# EAGLE design Arduino_MEGA_2560-Rev3 (EAGLE 6.1)
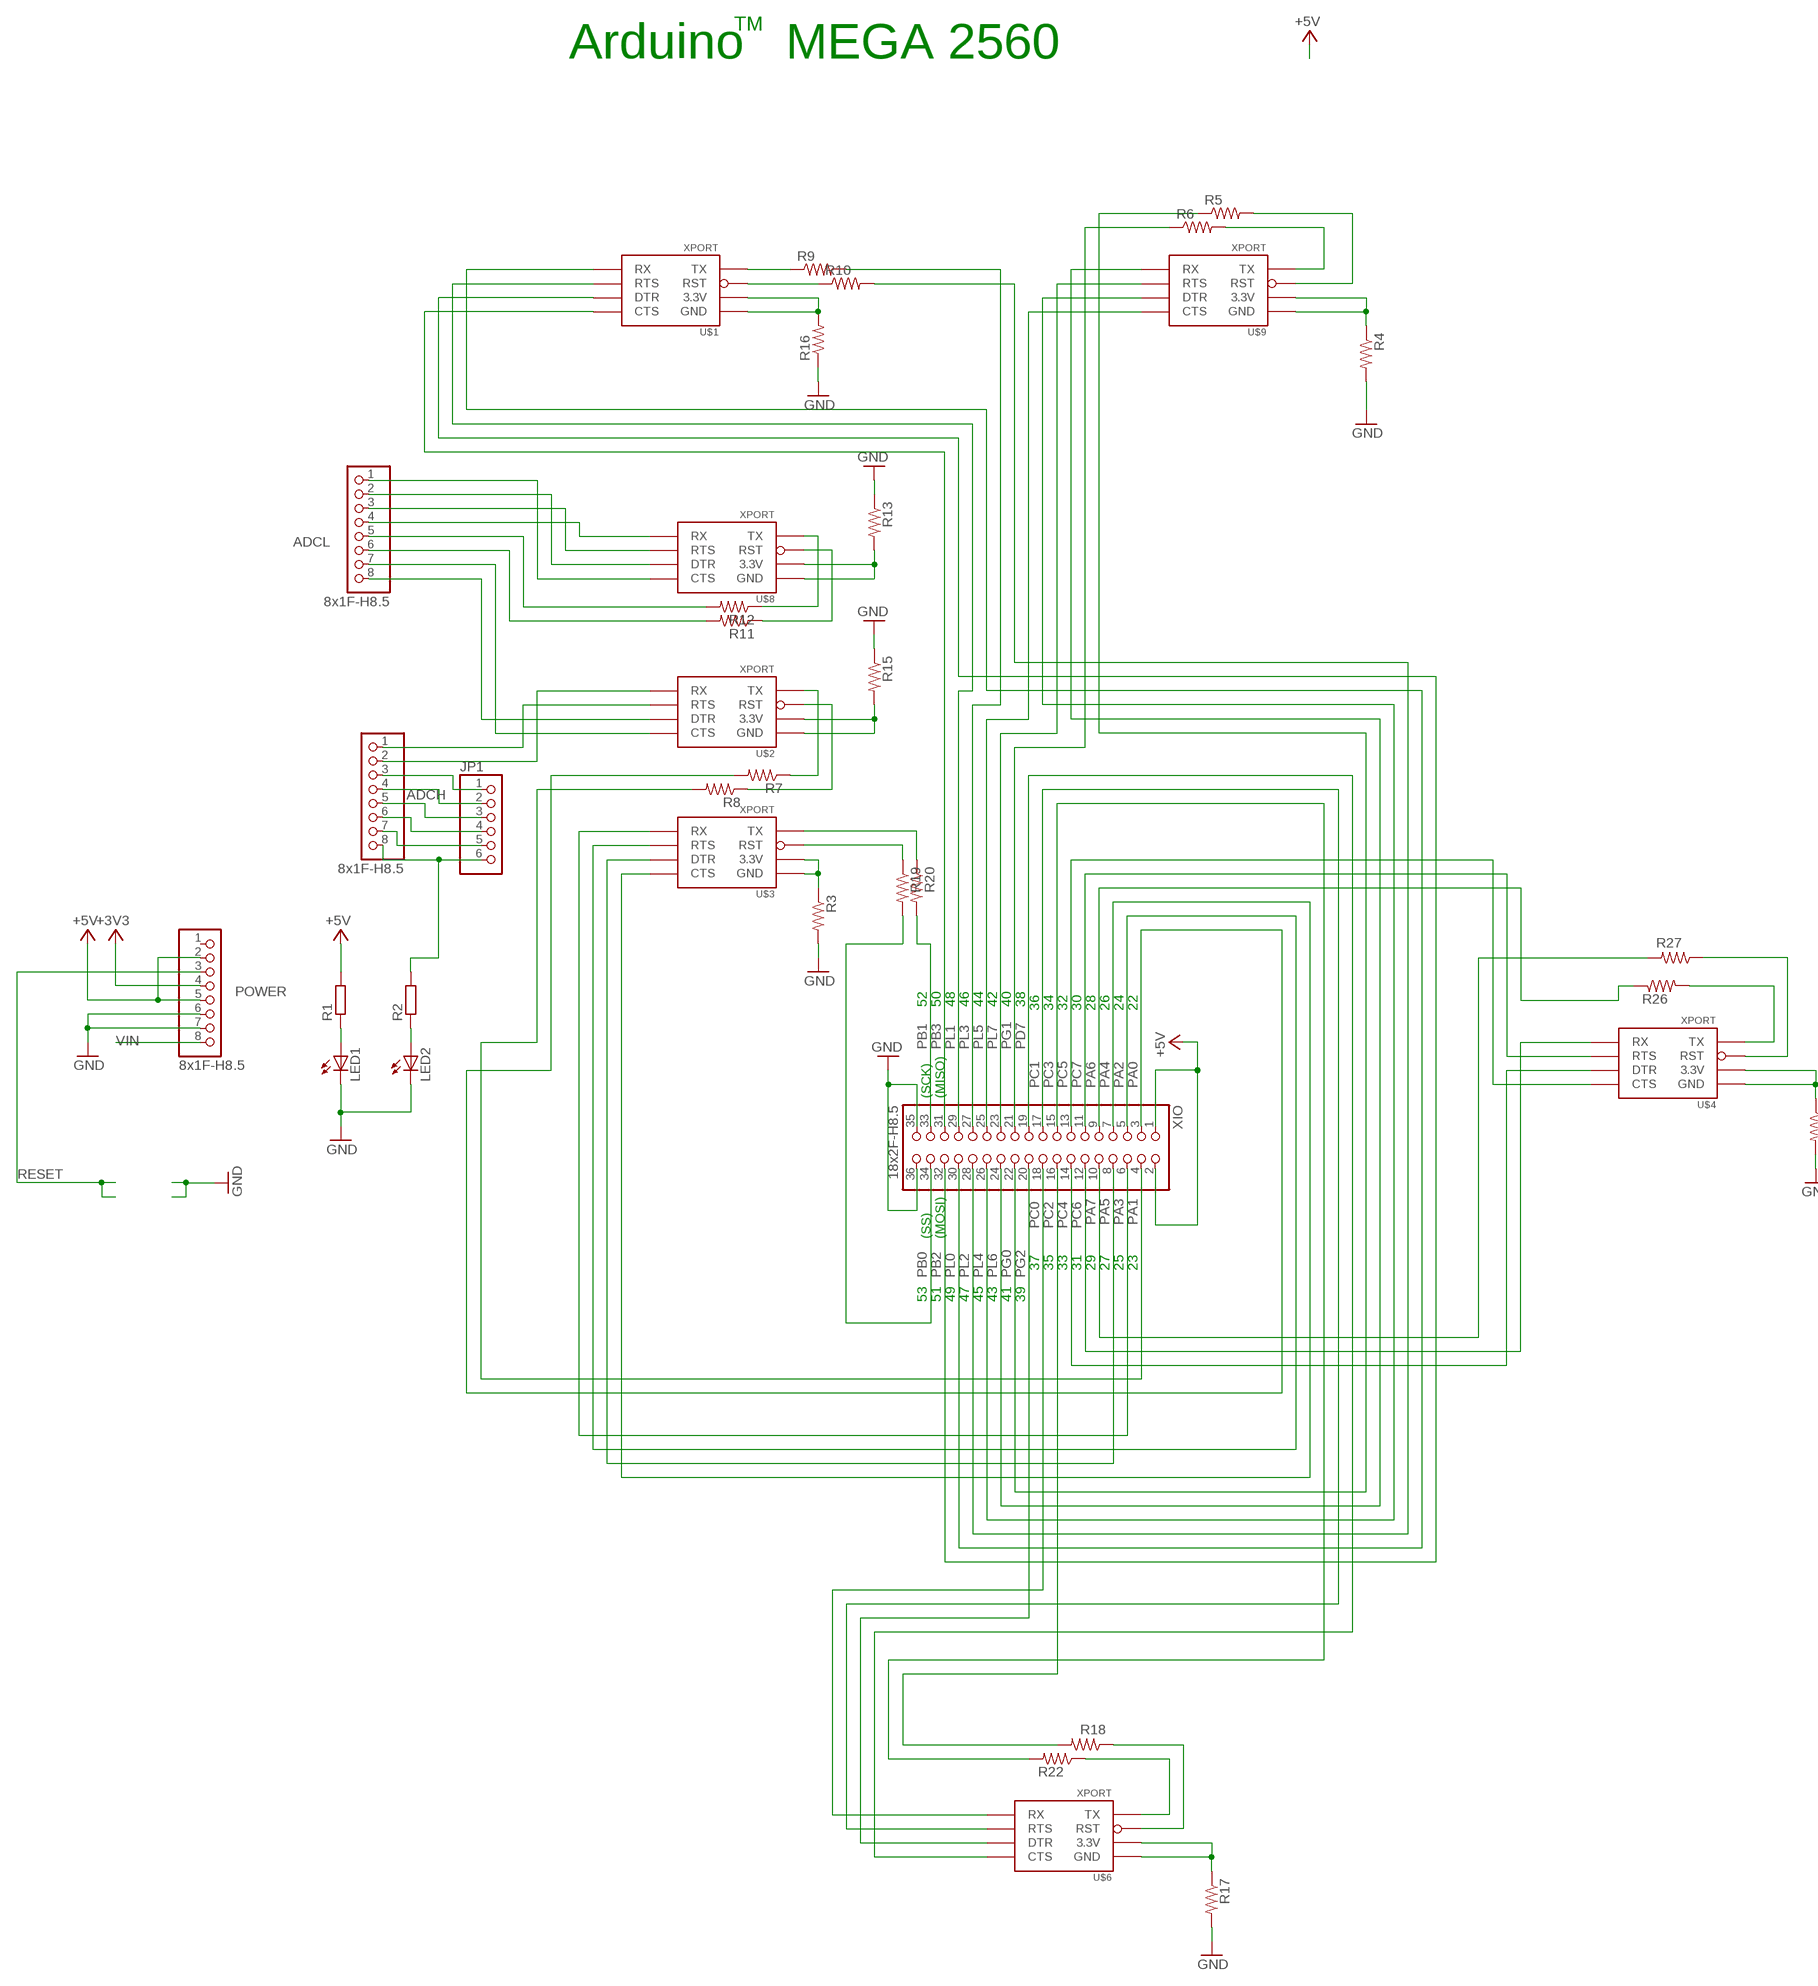
[diagram p0: schematic, sheet 1, part 1 of 2]
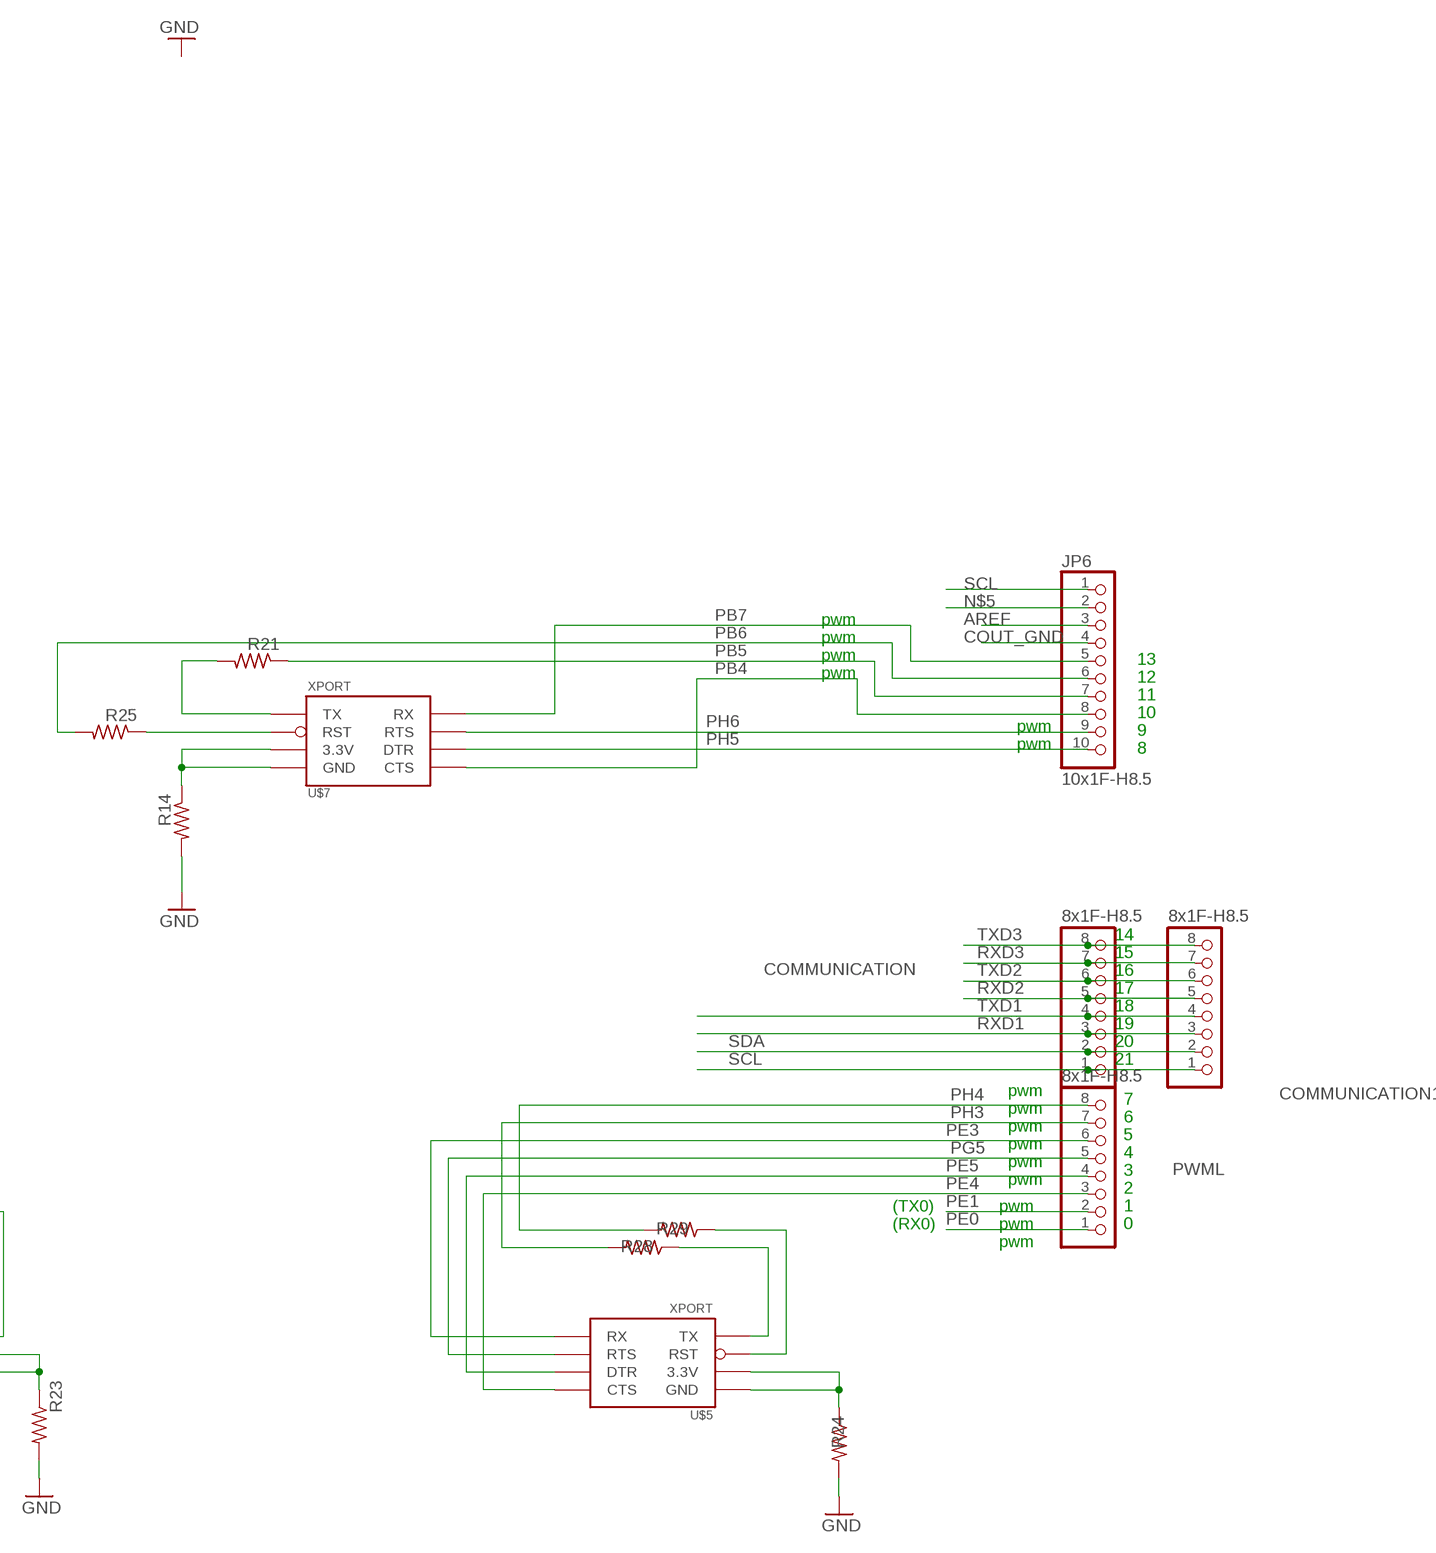
[diagram p1: schematic, sheet 1, part 2 of 2]

## Parts
ADCH  8x1F-H8.5  PINHD-1X8  [1X08]
ADCL  8x1F-H8.5  PINHD-1X8  [1X08]
COMMUNICATION  8x1F-H8.5  PINHD-1X8  [1X08]
COMMUNICATION1  8x1F-H8.5  PINHD-1X8  [1X08]
JP1  PINHD-1X6  [1X06]
JP6  10x1F-H8.5  PINHD-1X10_ARD  [1X10]
LED1  LEDCHIPLED_1206  [CHIPLED_1206]
LED2  LEDCHIPLED_1206  [CHIPLED_1206]
POWER  8x1F-H8.5  PINHD-1X8  [1X08]
PWML  8x1F-H8.5  PINHD-1X8  [1X08]
R1  R-EU_M1206  [M1206]
R2  R-EU_M1206  [M1206]
R3  R-US_0207/10  [0207/10]
R4  R-US_0207/15  [0207/15]
R5  R-US_0207/15  [0207/15]
R6  R-US_0207/15  [0207/15]
R7  R-US_0207/10  [0207/10]
R8  R-US_0207/10  [0207/10]
R9  R-US_0207/15  [0207/15]
R10  R-US_0207/15  [0207/15]
R11  R-US_0207/10  [0207/10]
R12  R-US_0207/10  [0207/10]
R13  R-US_0207/10  [0207/10]
R14  R-US_0207/10  [0207/10]
R15  R-US_0207/10  [0207/10]
R16  R-US_0207/15  [0207/15]
R17  R-US_0207/15  [0207/15]
R18  R-US_0207/15  [0207/15]
R19  R-US_0207/10  [0207/10]
R20  R-US_0207/10  [0207/10]
R21  R-US_0207/2V  [0207/2V]
R22  R-US_0207/15  [0207/15]
R23  R-US_0207/15  [0207/15]
R24  R-US_0207/15  [0207/15]
R25  R-US_0207/2V  [0207/2V]
R26  R-US_0207/15  [0207/15]
R27  R-US_0207/15  [0207/15]
R28  R-US_0207/15  [0207/15]
R29  R-US_0207/15  [0207/15]
U$1  XPORT  [XPORT]
U$2  XPORT  [XPORT]
U$3  XPORT  [XPORT]
U$4  XPORT  [XPORT]
U$5  XPORT  [XPORT]
U$6  XPORT  [XPORT]
U$7  XPORT  [XPORT]
U$8  XPORT  [XPORT]
U$9  XPORT  [XPORT]
XIO  18x2F-H8.5  PINHD-2X18  [2X18]

## Nets
+3V3 [power]: POWER.4
+5V [power usb]: POWER.2 POWER.5 R1.2 XIO.1 XIO.2
AREF: JP6.3
COUT_GND: JP6.4 LED1.C LED2.C POWER.6 POWER.7 R3.2 R4.2 R13.1 R14.2 R15.1 R16.1 R17.2 R23.2 R24.2 XIO.35 XIO.36 ; supply symbol labelled GND
N$1: LED1.A R1.1
N$2: LED2.A R2.1
N$3: ADCH.1 U$2.P6(RTS)
N$4: ADCH.2 U$2.P5(RX)
N$5: JP6.2
N$6 [gnd]: R14.1 U$7.P1(GND) U$7.P2(3.3V)
N$7: ADCL.1 U$8.P8(CTS)
N$8: ADCL.2 U$8.P7(DTR)
N$9: ADCL.3 U$8.P6(RTS)
N$10: ADCH.3 JP1.1
N$11: ADCL.4 U$8.P5(RX)
N$12: ADCL.5 R12.2
N$13: ADCL.6 R11.2
N$14: ADCL.7 U$2.P8(CTS)
N$15: ADCL.8 U$2.P7(DTR)
N$16 [gnd]: R15.2 U$2.P1(GND) U$2.P2(3.3V)
N$17 [gnd]: R3.1 U$3.P1(GND) U$3.P2(3.3V)
N$18 [gnd]: R4.1 U$9.P1(GND) U$9.P2(3.3V)
N$19: R5.2 U$9.P3(RST)
N$20: R6.2 U$9.P4(TX)
N$21: ADCH.4 JP1.2
N$22: ADCH.5 JP1.3
N$23: ADCH.6 JP1.4
N$24: ADCH.7 JP1.5
N$25: ADCH.8 JP1.6 R2.2
N$26 [gnd]: R16.2 U$1.P1(GND) U$1.P2(3.3V)
N$27: R10.1 U$1.P3(RST)
N$28: R9.1 U$1.P4(TX)
N$29 [gnd]: R17.1 U$6.P1(GND) U$6.P2(3.3V)
N$30: R7.1 U$2.P4(TX)
N$31: R8.1 U$2.P3(RST)
N$32: R22.1 U$6.P4(TX)
N$33: R18.1 U$6.P3(RST)
N$34 [gnd]: R24.1 U$5.P1(GND) U$5.P2(3.3V)
N$35 [gnd]: R23.1 U$4.P1(GND) U$4.P2(3.3V)
N$36: R19.1 U$3.P3(RST)
N$37: R20.2 XIO.33
N$38: R21.2 U$7.P4(TX)
N$39: R25.1 U$7.P3(RST)
N$40: R28.1 U$5.P4(TX)
N$41: R29.1 U$5.P3(RST)
N$42: R26.2 U$4.P4(TX)
N$43: R27.1 U$4.P3(RST)
N$44: R11.1 U$8.P3(RST)
N$45: R12.1 U$8.P4(TX)
N$46 [gnd]: R13.2 U$8.P1(GND) U$8.P2(3.3V)
PA0: R7.2 XIO.3
PA1: R8.2 XIO.4
PA2: U$3.P6(RTS) XIO.5
PA3: U$3.P5(RX) XIO.6
PA4: U$3.P8(CTS) XIO.7
PA5: U$3.P7(DTR) XIO.8
PA6: R26.1 XIO.9
PA7: R27.2 XIO.10
PB0: R19.2 XIO.34
PB1: R20.1 U$3.P4(TX)
PB2: U$1.P7(DTR) XIO.32
PB3: U$1.P8(CTS) XIO.31
PB4: JP6.8 U$7.P8(CTS)
PB5: JP6.7 R21.1
PB6: JP6.6 R25.2
PB7: JP6.5 U$7.P5(RX)
PC0: U$6.P5(RX) XIO.18
PC1: U$6.P6(RTS) XIO.17
PC2: R18.2 XIO.16
PC3: R22.2 XIO.15
PC4: U$4.P7(DTR) XIO.14
PC5: U$4.P8(CTS) XIO.13
PC6: U$4.P5(RX) XIO.12
PC7: U$4.P6(RTS) XIO.11
PD7: U$6.P8(CTS) XIO.19
PE0: PWML.1
PE1: PWML.2
PE3: PWML.6 U$5.P5(RX)
PE4: PWML.3 U$5.P8(CTS)
PE5: PWML.4 U$5.P7(DTR)
PG0: R5.1 XIO.22
PG1: R6.1 XIO.21
PG2: U$6.P7(DTR) XIO.20
PG5: PWML.5 U$5.P6(RTS)
PH3: PWML.7 R28.2
PH4: PWML.8 R29.2
PH5: JP6.10 U$7.P7(DTR)
PH6: JP6.9 U$7.P6(RTS)
PL0: U$1.P5(RX) XIO.30
PL1: U$1.P6(RTS) XIO.29
PL2: R10.2 XIO.28
PL3: R9.2 XIO.27
PL4: U$9.P7(DTR) XIO.26
PL5: U$9.P8(CTS) XIO.25
PL6: U$9.P5(RX) XIO.24
PL7: U$9.P6(RTS) XIO.23
RESET: POWER.3
RXD1: COMMUNICATION1.3 COMMUNICATION.3
RXD2: COMMUNICATION1.5 COMMUNICATION.5
RXD3: COMMUNICATION1.7 COMMUNICATION.7
SCL: COMMUNICATION1.1 COMMUNICATION.1 JP6.1
SDA: COMMUNICATION1.2 COMMUNICATION.2
TXD1: COMMUNICATION1.4 COMMUNICATION.4
TXD2: COMMUNICATION1.6 COMMUNICATION.6
TXD3: COMMUNICATION1.8 COMMUNICATION.8
VIN [power]: POWER.8
Unconnected: POWER.1

## Notes on the sheet
- TM
- Arduino   MEGA 2560
- pwm
- pwm
- pwm | 13
- pwm | 12
- 11
- 10
- pwm | 9
- pwm | 8
- 14
- 15
- 16
- 17
- 18
- 19
- 20
- 21
- pwm
- 7
- pwm
- 6
- pwm
- 5
- pwm
- 4
- pwm
- 3
- pwm
- 2
- (TX0) | pwm | 1
- (RX0) | pwm | 0
- pwm
- 52 | 50 | 48 | 46 | 44 | 42 | 40 | 38 | 36 | 34 | 32 | 30 | 28 | 26 | 24 | 22
- (SCK) | (MISO)
- (SS) | (MOSI)
- 37 | 35 | 33 | 31 | 29 | 27 | 25 | 23
- 53 | 51 | 49 | 47 | 45 | 43 | 41 | 39

## Library data of the parts
ADCH ADCL COMMUNICATION COMMUNICATION1 POWER PWML = SmartPrj:PINHD-1X8: PIN HEADER
JP1 = pinhead:PINHD-1X6: PIN HEADER
JP6 = SmartPrj:PINHD-1X10_ARD: PIN HEADER
LED1 LED2 = led:LED: LED OSRAM: - CHIPLED LG R971, LG N971, LY N971, LG Q971, LY Q971, LO R971, LY R971 LH N974, LH R974 LS Q976, LO Q976, LY Q976 LO Q996 - Hyper CHIPLED LW Q18S LB Q993, LB Q99A, LB R99A - SideLED LS A670, LO A670, LY A670, LG A670, LP A670 LB A673, LV A673, LT A673, LW A673 LH A674 LY A675 LS A676, LA A676, LO A676, LY A676, LW A676 LS A679, LY A679, LG A679 - Hyper Micro SIDELED® LS Y876, LA Y876, LO Y876, LY Y876 LT Y87S - SmartLED LW L88C, LW L88S LB L89C, LB L89S, LG L890 LS L89K, LO L89K, LY L89K LS L896, LA L896, LO L896, LY L896 - TOPLED LS T670, LO T670, LY T670, LG T670, LP T670 LSG T670, LSP T670, LSY T670, LOP T670, LYG T670 LG T671, LOG T671, LSG T671 LB T673, LV T673, LT T673, LW T673 LH T674 LS T676, LA T676, LO T676, LY T676, LB T676, LH T676, LSB T676, LW T676 LB T67C, LV T67C, LT T67C, LS T67K, LO T67K, LY T67K, LW E67C LS E67B, LA E67B, LO E67B, LY E67B, LB E67C, LV E67C, LT E67C LW T67C LS T679, LY T679, LG T679 LS T770, LO T770, LY T770, LG T770, LP T770 LB T773, LV T773, LT T773, LW T773 LH T774 LS E675, LA E675, LY E675, LS T675 LS T776, LA T776, LO T776, LY T776, LB T776 LHGB T686 LT T68C, LB T68C - Hyper Mini TOPLED® LB M676 - Mini TOPLED Santana® LG M470 LS M47K, LO M47K, LY M47K Source: http://www.osram.convergy.de LUXEON: - LUMILED® LXK2-PW12-R00, LXK2-PW12-S00, LXK2-PW14-U00, LXK2-PW14-V00 LXK2-PM12-R00, LXK2-PM12-S00, LXK2-PM14-U00 LXK2-PE12-Q00, LXK2-PE12-R00, LXK2-PE12-S00, LXK2-PE14-T00, LXK2-PE14-U00 LXK2-PB12-K00, LXK2-PB12-L00, LXK2-PB12-M00, LXK2-PB14-N00, LXK2-PB14-P00, LXK2-PB14-Q00 LXK2-PR12-L00, LXK2-PR12-M00, LXK2-PR14-Q00, LXK2-PR14-R00 LXK2-PD12-Q00, LXK2-PD12-R00, LXK2-PD12-S00 LXK2-PH12-R00, LXK2-PH12-S00 LXK2-PL12-P00, LXK2-PL12-Q00, LXK2-PL12-R00 Source: www.luxeon.com KINGBRIGHT: KA-3528ASYC Source: www.kingbright.com
R1 R2 = resistor:R-EU_: RESISTOR, European symbol
R3-R29 = rcl:R-US_: RESISTOR, American symbol
U$1-U$9 = SparkFun-Boards:XPORT: TCP/IP stack and phy in RJ-45 jack footprint
XIO = SmartPrj:PINHD-2X18: PIN HEADER

## Net classes
0 default: width 0.203 mm, drill 0.406 mm, clearance 0.203 mm
1 power: width 0.61 mm, drill 0.406 mm, clearance 0.203 mm
2 gnd: width 0.305 mm, drill 0.406 mm, clearance 0.203 mm
3 power usb: width 0.508 mm, drill 0.406 mm, clearance 0.203 mm

## Board
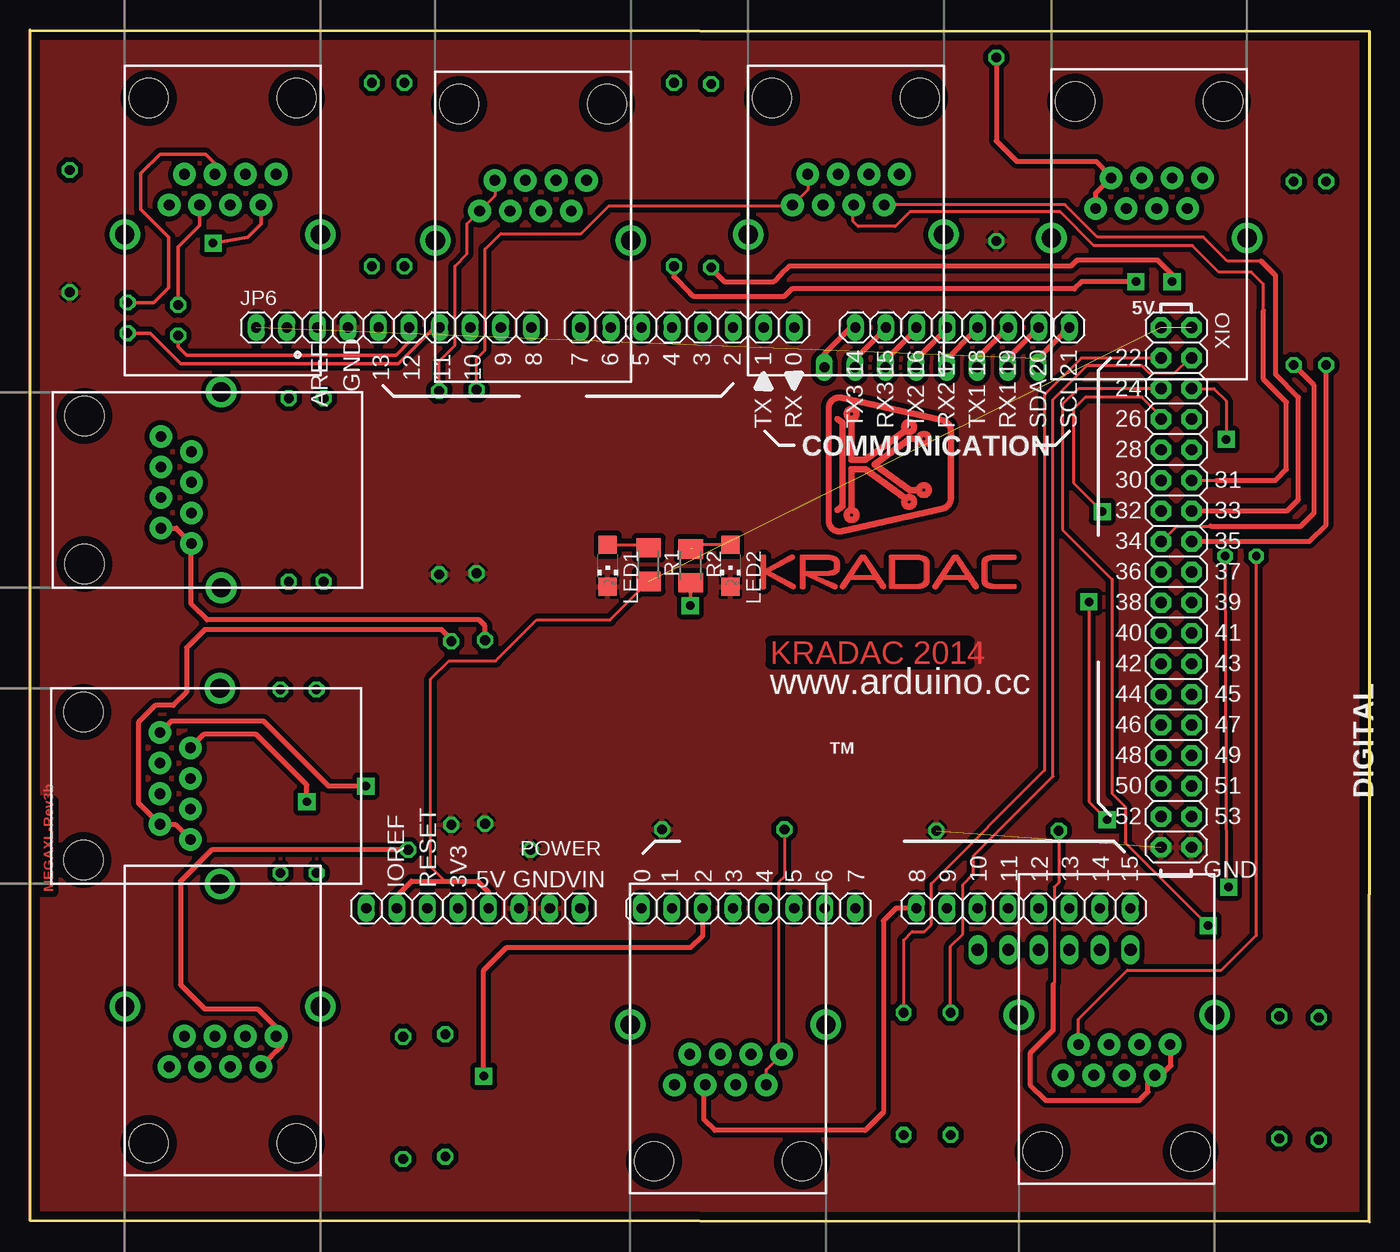
[diagram p2: board, top side]
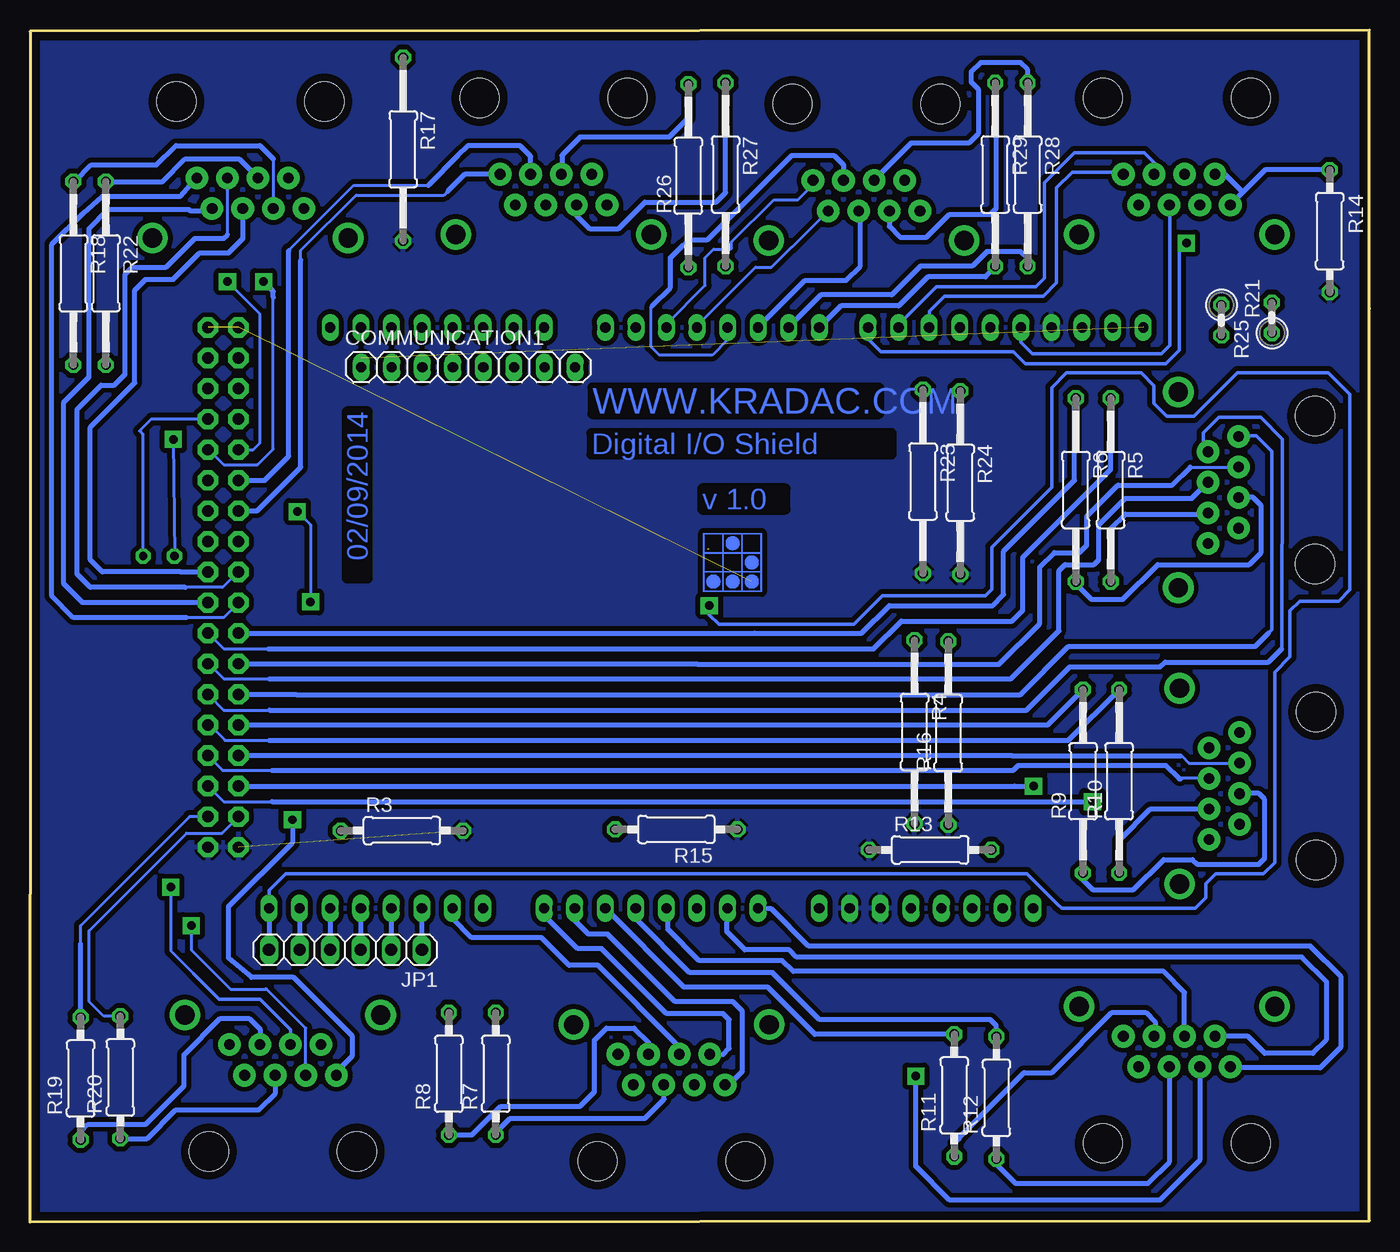
[diagram p3: board, bottom side, seen from below]

Size 111.3 x 99 mm. Coordinates in mm from the lower left corner, seen from the top.
Outline: 0,75.84 0,0.1 111.3,0 111.3,27.2
Outline: 0,75.9 0,99 111.3,98.9 111.3,27.21
Copper layers (1*16): Top 0.035mm / dielectric 1.5mm / Bottom 0.035mm
Design rules: minimum track width 8mil, minimum drill 16mil, track to track 7mil, track to pad 7mil, pad to pad 8mil, via to via 10mil, smd to smd 7mil, copper to edge 27mil, drill to drill 12mil, minimum pad ring 10mil, minimum via ring 10mil, stop-mask expansion 2mil, vias tented up to drill 24mil, thermal gap 10mil

### Footprints (pad centres in the part's own frame; a part is rotated, then mirrored left to right if it is on the bottom)
1X08 = drill 0.85 pad 1.422 long: 1 -8.89,0; 2 -6.35,0; 3 -3.81,0; 4 -1.27,0; 5 1.27,0; 6 3.81,0; 7 6.35,0; 8 8.89,0
1X06 = drill 1.016 long: 1 -6.35,0; 2 -3.81,0; 3 -1.27,0; 4 1.27,0; 5 3.81,0; 6 6.35,0
1X10 = drill 0.85 pad 1.422 long: 1 -11.43,0; 2 -8.89,0; 3 -6.35,0; 4 -3.81,0; 5 -1.27,0; 6 1.27,0; 7 3.81,0; 8 6.35,0; 9 8.89,0; 10 11.43,0
CHIPLED_1206 = smd 1.5 x 1.5: A 0,-1.75; C 0,1.75
M1206 = smd 1.6 x 2: 1 -1.4,0; 2 1.4,0
0207/10 = drill 0.813 octagon: 1 -5.08,0; 2 5.08,0
0207/15 = drill 0.813 octagon: 1 -7.62,0; 2 7.62,0
0207/2V = drill 0.813 octagon: 1 -1.27,0; 2 1.27,0
XPORT = drill 0.889 pad 1.88: 1 -3.175,7.62; 8 4.445,7.62; 10 -4.445,5.08; P1 4.445,7.62; P2 3.175,5.08; P3 1.905,7.62; P4 0.635,5.08; P5 -0.635,7.62; P6 -1.905,5.08; P7 -3.175,7.62; P8 -4.445,5.08 | drill 1.6 pad 2.54: GND@9 -8.128,10.081; GND@10 8.128,10.081 | hole 3.251: -6.147,-1.27; 6.147,-1.27
2X18 = drill 0.95 pad 1.676 octagon: 1 -21.59,-1.27; 2 -21.59,1.27; 3 -19.05,-1.27; 4 -19.05,1.27; 5 -16.51,-1.27; 6 -16.51,1.27; 7 -13.97,-1.27; 8 -13.97,1.27; 9 -11.43,-1.27; 10 -11.43,1.27; 11 -8.89,-1.27; 12 -8.89,1.27; 13 -6.35,-1.27; 14 -6.35,1.27; 15 -3.81,-1.27; 16 -3.81,1.27; 17 -1.27,-1.27; 18 -1.27,1.27; 19 1.27,-1.27; 20 1.27,1.27; 21 3.81,-1.27; 22 3.81,1.27; 23 6.35,-1.27; 24 6.35,1.27; 25 8.89,-1.27; 26 8.89,1.27; 27 11.43,-1.27; 28 11.43,1.27; 29 13.97,-1.27; 30 13.97,1.27; 31 16.51,-1.27; 32 16.51,1.27; 33 19.05,-1.27; 34 19.05,1.27; 35 21.59,-1.27; 36 21.59,1.27

### Placement (x,y rotation side)
ADCH  82.55,26.04 0 top
ADCL  59.69,26.04 0 top
COMMUNICATION  77.47,74.3 180 top
COMMUNICATION1  74.9,71 0 bottom
JP1  85.1,22.6 180 bottom
JP6  30.23,74.3 0 top
LED1  48,54.5 180 top
LED2  58.2,54.5 180 top
POWER  36.83,26.04 0 top
PWML  54.61,74.3 180 top
R1  51.4,54.6 270 top
R2  54.9,54.5 270 top
R3  80.4,32.5 0 bottom
R4  37.8,40.7 270 bottom
R5  21.5,60.8 270 bottom
R6  24.4,60.8 270 bottom
R7  72.6,12.3 90 bottom
R8  76.5,12.3 90 bottom
R9  23.8,36.6 90 bottom
R10  20.8,36.6 90 bottom
R11  34.5,10.5 90 bottom
R12  31,10.3 90 bottom
R13  36.5,30.9 0 bottom
R14  3.3,82.3 270 bottom
R15  57.6,32.6 180 bottom
R16  35,40.6 90 bottom
R17  80.3,89.1 270 bottom
R18  107.7,78.8 270 bottom
R19  107.1,11.9 90 bottom
R20  103.8,12 90 bottom
R21  8.1,75.1 90 bottom
R22  105,78.8 270 bottom
R23  37.1,61.5 270 bottom
R24  34,61.4 270 bottom
R25  12.3,74.9 270 bottom
R26  56.6,86.9 90 bottom
R27  53.5,87 270 bottom
R28  28.4,87 270 bottom
R29  31.1,87 270 bottom
U$1  5.7,36.2 270 top
U$2  58,6.3 0 top
U$3  90.3,7.1 0 top
U$4  67.8,92.1 180 top
U$5  41.8,91.6 180 top
U$6  93,91.8 180 top
U$7  16,92.1 180 top
U$8  16,7.8 0 top
U$9  5.8,60.8 270 top
XIO  95.25,52.71 270 top

### Tracks (layer width: path | path; a pad name or v marks a point on that pad's centre or on a via)
+5V  (2 unrouted)
  Top 0.254: 37.2,28.3 34.5,28.3 33.3,29.5 33.3,45.1 34.8,46.6 38.7,46.6 39.9,47.8 | 39.9,47.8 | 39.9,47.8 42.1,50 48.2,50 R1.2
  Top 0.406: POWER.2 30.48,27.08 31.7,28.3 37.2,28.3 38.1,27.4 POWER.5 | POWER.5
COUT_GND  (1 unrouted)
  pour Top (isolate 0.406, rank 5): 0,0.1 111.3,0.1 111.3,98.9 0,98.9
  pour Bottom (isolate 0.406, rank 4): 0,0.1 111.3,0.1 111.3,98.9 0,98.9
N$1
  Top 0.254: LED1.A 51.15,56.25 R1.1
N$2  (1 unrouted)
  Top 0.254: LED2.A 55.35,56.25 55,55.9
N$3
  Top 0.406: ADCH.1 71.94,26.04 70.9,25 70.9,9.1 69.4,7.6 56.9,7.6 56,8.5 56,11.29 U$2.P6
N$4
  Bottom 0.406: U$2.P5 57.37,14.56 64.1,21.3 66.5,21.3 68.8,23.6 74.6,23.6 76.2,25.2 ADCH.2 | ADCH.2
N$6
  Bottom 0.406: R14.1 8.65,87.38 10.52,85.52 | 10.52,85.52 U$7.P1 | U$7.P2 12.02,87.02 10.52,85.52
N$7
  Bottom 0.406: 50.44,26.04 ADCL.1 50.76,26 49.7,26 46.6,22.9 4.9,22.9 2.4,20.4 2.4,14.5 4.1,12.8 11.47,12.8 U$8.P8
N$8
  Bottom 0.406: 53.34,25.64 ADCL.2 53.4,25.98 53.4,24.1 51.9,22.6 48.2,22.6 47.6,22 5.6,22 3.6,20 3.6,15.1 4.7,14 8.7,14 10.1,15.4 12.8,15.4 U$8.P7
N$9  (via drill 0.7 pad 1.42)
  Top 0.406: v37.7,12.1 37.7,20.9 39.6,22.8 54.9,22.8 55.9,23.8 55.9,26.02 ADCL.3
  Bottom 0.406: U$8.P6 14.1,5.11 17.4,1.8 34.9,1.8 37.7,4.6 v37.7,12.1
N$10
  Bottom 0.406: JP1.1 ADCH.3
N$11
  Bottom 0.406: U$8.P5 15.37,19.07 17.1,20.8 47.9,20.8 48.8,21.7 55.7,21.7 58.3,24.3 58.3,25.92 ADCL.4
N$12
  Bottom 0.406: R12.2 31,16.3 31.5,16.8 45.7,16.8 49.6,20.7 56.5,20.7 61,25.2 61,26 ADCL.5
N$13
  Bottom 0.406: R11.2 46.08,15.58 50,19.5 56.96,19.5 ADCL.6
N$14
  Bottom 0.406: U$2.P8 53.22,11.38 52.1,12.5 52.1,17.5 52.9,18.3 57.7,18.3 63.3,23.9 64.9,23.9 66.04,25.04 ADCL.7
N$15
  Bottom 0.406: U$2.P7 53.68,13.92 53.2,14.4 53.2,16.8 53.7,17.3 58.4,17.3 63.8,22.7 65.8,22.7 68.5,25.4 68.5,25.96 ADCL.8
N$16
  Top 0.254: R15.2 62.68,28.68 62.2,28.2 62.2,14.16 U$2.P1 61.17,12.65 U$2.P2
N$17
  Top 0.254: R3.1 85.48,28.18 85.1,27.8 85.1,19.8 85,19.7
  Top 0.406: 85,19.7 85,15.9 83.1,14 83.1,11.4 84.4,10.1 92.2,10.1 92.9,10.8 92.9,11.61 U$3.P2 93.98,12.18 94.8,13 94.8,14.66 U$3.P1
N$18
  Top 0.406: R4.1 37.8,49.5 37.3,50 14.7,50 13.4,51.3 13.4,56.34 U$9.P1 12.15,57.62 U$9.P2
N$19
  Bottom 0.406: R5.2 21.5,57.6 20.3,58.8 13.52,58.8 U$9.P3
N$20
  Bottom 0.406: R6.2 24.4,53 23.1,51.7 20.5,51.7 17.6,54.6 10,54.6 9,55.6 9,59.5 9.7,60.2 10.85,60.2 U$9.P4
N$21
  Bottom 0.406: ADCH.4 JP1.2
N$22
  Bottom 0.406: ADCH.5 JP1.3
N$23
  Bottom 0.406: ADCH.6 JP1.4
N$24
  Bottom 0.406: ADCH.7 JP1.5
N$25  (via drill 0.7 pad 1.42)
  Top 0.305: v54.86,51.19 54.86,53.06 R2.2
  Bottom 0.305: ADCH.8 91.44,27.54 90.07,28.91 28.47,28.91 25.98,26.42 25.96,26.42 25.58,26.04 14.45,26.04 13.59,26.9 13.59,28.07 12.75,28.91 8.81,28.91 7.87,29.85 7.87,45.67 6.6,46.94 6.6,50.75 5.79,51.57 2.56,51.57 1.63,52.51 1.63,68.74 3.4,70.52 11,70.52 14.58,66.93 16.84,66.93 17.91,68 17.91,69.47 18.95,70.52 25.17,70.52 26.39,69.3 26.39,61.02 31.37,56.04 31.37,52.56 31.93,52 40.49,52 42.85,49.64 54.05,49.64 54.86,50.45 v54.86,51.19
  Bottom 0.406: ADCH.8 JP1.6
N$26
  Top 0.406: R16.2 35,48.4 34.2,49.2 14.5,49.2 13,47.7 13,44 11.9,42.9 10.4,42.9 9,41.5 9,34.8 U$1.P2 12.05,33.02 U$1.P1
N$27
  Bottom 0.406: R10.1 20.8,31.7 18.2,34.3 U$1.P3
N$28
  Bottom 0.406: R9.1 23.8,28.4 23,27.6 19.6,27.6 17.1,30.1 14.7,30.1 14.3,29.7 9.2,29.7 8.7,30.2 8.7,35.1 9.2,35.6 10.74,35.6 U$1.P4
N$29
  Top 0.406: R17.1 80.3,89.8 82,88.1 88.6,88.1 89.83,86.88 U$6.P2 88.56,85.45 U$6.P1
N$30
  Bottom 0.406: R7.1 72.6,7.4 71.4,8.6 60.2,8.6 58.6,10.2 58.6,11.35 U$2.P4
N$31
  Bottom 0.406: R8.1 74.58,7.22 72.4,9.4 | 72.4,9.4 | 72.4,9.4 72.2,9.6 65.6,9.6 64.4,10.8 64.4,15.1 63.4,16.1 61.1,16.1 59.9,14.9 U$2.P3
N$32
  Bottom 0.406: R22.1 100.28,86.42 98.4,88.3 93.94,88.3 U$6.P4
N$33
  Bottom 0.254: 91.1,88.3 U$6.P3
  Bottom 0.406: R18.1 107.58,86.42 106.2,87.8 100.8,87.8 99.2,89.4 92.2,89.4 91.1,88.3
N$34
  Top 0.254: R24.1 34,71.5 35.3,72.8 35.3,79.4 36.3,80.4 36.3,82.92 U$5.P1 38.62,85.25 U$5.P2
N$35
  Top 0.254: R23.1 37.1,71.7 37.8,72.4 37.8,80.8 39.1,82.1 45.8,82.1 47.8,84.1 | 47.8,84.1 | 47.8,84.1 48.1,84.4 63.27,84.4 U$4.P1 64.62,85.75 U$4.P2
N$36
  Bottom 0.406: R19.1 107.1,7.5 106.5,8.1 101.7,8.1 98.5,11.3 98.5,13.9 95.5,16.9 93.1,16.9 92.2,16 U$3.P3
N$37
  Bottom 0.254: R20.2 105.18,17.08 106.4,18.3 106.4,24.2 98.3,32.3 95.34,32.3 XIO.33
N$38
  Top 0.305: R21.2 10.27,76.37 11.5,77.6 11.5,81.8 9.2,84.1 9.2,87.1 10.8,88.7 14.6,88.7 15.4,87.9 15.4,87.06 U$7.P4
N$39
  Top 0.305: R25.1 12.3,81 14.1,82.8 U$7.P3
N$40
  Bottom 0.406: R28.1 28.4,95.7 29,96.3 32.3,96.3 33.1,95.5 33.1,94.7 32.5,94.1 32.5,90.4 33.3,89.6 38.09,89.6 U$5.P4
N$41
  Bottom 0.406: U$5.P3 39.9,82.69 39,81.8 36.8,81.8 34.9,83.7 31.5,83.7 31,84.2 31,94.52 R29.1
N$42
  Bottom 0.406: R26.2 56.6,91.7 58.2,90.1 65.6,90.1 67.1,88.6 67.1,87.09 U$4.P4
N$43
  Bottom 0.406: U$4.P3 65.89,83.59 64.8,82.5 62.4,82.5 60.2,84.7 54.3,84.7 53.5,85.5 R27.1
N$44
  Bottom 0.406: R11.1 34.5,6.5 34.1,6.9 34.1,7 28.7,12.4 26.4,12.4 21.4,17.4 18.6,17.4 17.8,16.6 17.8,15.53 U$8.P3
N$45
  Bottom 0.406: R12.1 31,4.8 29.4,3.2 18.4,3.2 16.6,5 16.6,12.85 U$8.P4
N$46
  Top 0.406: R13.2 15.1,30.9 12.5,28.3 12.5,19.7 14.5,17.7 18.9,17.7 20.9,15.7 | 20.9,15.7 20.9,14.6 20,13.7 U$8.P2 | 20.9,15.7 20.73,15.7 U$8.P1
N$47
  cutout Top: 60.54,53.18 74.37,53.18 74.37,54.78 71.67,54.78 71.67,54.77 71.56,54.77 71.56,54.03 64.1,54.03 64.1,55.07 63.12,55.07 62.09,54.04 60.54,54.04
N$48
  cutout Top: 68.25,58.78 68.28,58.78 68.28,67.85 76.33,66.02 76.28,59.62 68.22,58.22
N$49
  cutout Bottom: 50.57,52.43 55.3,52.41 55.3,57.13 50.57,57.13
N$50
  pour Bottom: 50.55,52.2 55.5,52.2 55.5,57.41 50.47,57.41 50.47,52.2
PA0
  Top 0.254: XIO.3 87.36,71.76 84.3,68.7 84.3,37.5 74.9,28.1 74.9,24.7 74.3,24.1 73.3,24.1 72.6,23.4 R7.2
PA1
  Top 0.254: R8.2 76.5,22.9 77.5,23.9 77.5,28 78.4,28.9 78.4,30.4 85,37 85,68.3 87.8,71.1 92.4,71.1 93,70.5 95.1,70.5 96.36,71.76 XIO.4
PA2  (via drill 0.7 pad 1.42)
  Top 0.254: XIO.5 87.12,69.22 85.8,67.9 85.8,57.5 89.9,53.4 89.9,35.6 91,34.5 91,31.5 v97.9,24.6
  Bottom 0.254: U$3.P6 88.39,16.09 91.6,19.3 | 91.7,19.4 91.6,19.3 | 91.6,19.3 94.6,19.3 97.9,22.6 v97.9,24.6
PA3  (via drill 0.7 pad 1.27, 0.7 pad 1.42)
  Top 0.254: XIO.6 98.38,69.22 99.4,68.2 v99.4,65 | v99.3,55.3 99.4,28 v99.6,27.8
  Bottom 0.254: v99.4,65 v99.3,55.3 | v99.6,27.8 99.6,22.5 97.7,20.6
  Bottom 0.305: U$3.P5 89.67,15.96 92.2,18.5 95.6,18.5 97.7,20.6
PA4  (via drill 0.7 pad 1.42)
  Top 0.254: XIO.7 93.98,66.92 92.4,68.5 87.7,68.5 86.7,67.5 86.7,61.4 v89.1,59 | v88,51.5 88,34.9 v89.5,33.4
  Bottom 0.254: v89.1,59 88,57.9 v88,51.5
  Bottom 0.406: U$3.P8 85.86,12.45 84.5,13.8 84.5,15.4 89.4,20.3 92.9,20.3 94.8,21.9 94.8,26.2 89.5,31.5 v89.5,33.4
PA5  (via drill 0.7 pad 1.27)
  Top 0.254: U$3.P7 87.12,16.82 91.2,20.9 99,20.9 100.5,22.4 | 100.5,22.4 | 100.5,22.4 101.9,23.8 v101.9,55.3
  Bottom 0.254: XIO.8 101.22,66.68 102.2,65.7 101.9,65.4 v101.9,55.3
PA6  (via drill 0.7 pad 1.42)
  Top 0.406: R26.1 56.6,79.2 57.7,78.1 61.8,78.1 62.4,78.7 | v94.9,78.1 94.9,78.7 93.7,79.9 87,79.9 86.5,79.4 63.1,79.4 62.4,78.7 | 62.4,78.7
  Bottom 0.254: XIO.9 92.76,64.14 92.2,64.7 92.2,75.4 v94.9,78.1
PA7  (via drill 0.7 pad 1.42)
  Top 0.406: R27.2 53.5,78.5 54.8,77.2 | 54.8,77.2 | 54.8,77.2 55.1,76.9 62.7,76.9 63.3,77.5 86.8,77.5 87.4,78.1 v91.9,78.1
  Bottom 0.254: XIO.10 96.44,64.14 95.2,62.9 92.4,62.9 91.1,64.2 91.1,76.8
  Bottom 0.406: 91.1,76.8 91.1,77.3 v91.9,78.1
PB0
  Bottom 0.254: XIO.34 98.04,33.66 107.1,24.6 107.1,23.08
  Bottom 0.406: R19.2 107.1,23.08
PB1
  Bottom 0.406: R20.1 101.58,6.92 99.2,9.3 92.3,9.3 90.9,10.7 90.9,12.14 U$3.P4
PB2  (via drill 0.7 pad 1.42)
  Top 0.406: v23,34.9 23,36.3 18.8,40.5 14.45,40.5 U$1.P7
  Bottom 0.254: XIO.32 96.5,36.2 95.2,34.9 91.2,34.9
  Bottom 0.406: 91.2,34.9 v23,34.9
PB3  (via drill 0.7 pad 1.42)
  Top 0.406: v27.9,36.2 24.8,36.2 19.4,41.6 11.73,41.6 U$1.P8
  Bottom 0.406: XIO.31 29.5,36.2 | 29.5,36.2 | 29.5,36.2 v27.9,36.2
PB4
  Bottom 0.305: JP6.8 36.58,75.62 35.3,76.9 27.1,76.9 26,78 26,85.9 24.7,87.2 20.62,87.2 U$7.P8
PB5
  Top 0.305: R21.1 9.97,73.83 12.5,71.3 30.6,71.3 33.4,74.1 33.84,74.1 JP6.7
PB6
  Top 0.305: R25.2 12.3,72.7 13,72 30.4,72 31.5,73.1 JP6.6
PB7
  Bottom 0.305: JP6.5 28.96,73.06 28,72.1 17.3,72.1 16.6,72.8 16.6,84.44 U$7.P5
PC0
  Bottom 0.406: XIO.18 98.78,53.98 98.8,54 105.3,54 106.3,55 106.3,66 102.6,69.7 102.6,77.4 101.7,78.3 99.4,78.3 97.2,80.5 94.8,80.5 93.6,81.7 93.6,84.15 U$6.P5
PC1
  Bottom 0.254: XIO.17 94.02,53.98 95.3,52.7 98.4,52.7 | 94.9,82 U$6.P6
  Bottom 0.406: 98.4,52.7 106.3,52.7 107.4,53.8 107.4,67.5 105.4,69.5 104.3,69.5 103.4,70.4 103.4,78.7 102.8,79.3 100,79.3 97.6,81.7 95.2,81.7 94.9,82
PC2
  Top 0.406: XIO.16 106.32,56.52 107.7,57.9 R18.2
PC3
  Top 0.254: XIO.15 94.02,56.52 95.3,57.8 98.1,57.8
  Top 0.406: 98.1,57.8 105.6,57.8 106.7,58.9 106.7,69.48 R22.2
PC4
  Top 0.254: 102.3,79.8 99.5,79.8 97.5,81.8 88.7,81.8 86,84.5 71,84.5 U$4.P7
  Top 0.406: XIO.14 104.46,59.06 105.4,60 105.4,68.5 103.5,70.4 103.5,78.6 102.3,79.8
PC5
  Bottom 0.254: 88.8,79.9 88.8,80.7 84.2,85.3 76.9,85.3 76.6,85.6
  Bottom 0.406: U$4.P8 75.18,87.02 76.6,85.6 | XIO.13 92.44,59.06 88.8,62.7 88.8,79.9
PC6
  Top 0.254: XIO.12 98.6,61.6 | 98.6,61.6 | 102.5,75.7 102.5,77.9 101.5,78.9 98.8,78.9 96.6,81.1 88.4,81.1 85.6,83.9 73.1,83.9 71.9,82.7 68.8,82.7 68.4,83.1 68.4,84.44 U$4.P5
  Top 0.406: 98.6,61.6 103.5,61.6 104.4,62.5 104.4,68.1 102.5,70 102.5,75.7
PC7
  Bottom 0.254: 89.8,80.7 84.4,86.1 78.2,86.1
  Bottom 0.406: U$4.P6 69.7,88.5 70.6,89.4 74.9,89.4 75.8,88.5 | 75.8,88.5 | 75.8,88.5 78.2,86.1 | XIO.11 91.8,61.6 89.8,63.6 89.8,80.7
PD7
  Bottom 0.254: XIO.19 93.98,51.42 95.2,50.2 98.3,50.2
  Bottom 0.406: 98.3,50.2 107.7,50.2 109.5,52 109.5,81.2 106.9,83.8 | 106.9,83.8 | 106.9,83.8 105.3,85.2 98.77,85.2 U$6.P8
PE3
  Bottom 0.406: PWML.6 | PWML.6 46.9,78.2 43.5,78.2 42.3,79.4 42.3,83.84 U$5.P5
PE4
  Bottom 0.254: PWML.3 58.42,74.58 55.2,77.8 55.2,80.1 54.5,80.8 53.1,80.8 53,80.9 53,81.4 49.5,84.9 47.5,84.9 46.24,86.16 U$5.P8
PE5
  Bottom 0.254: PWML.4 55.88,74.42 51,79.3 49.7,79.3 48,81 47.95,81 U$5.P7
PG0
  Bottom 0.254: XIO.22 96.5,48.9 95.2,47.6 91.5,47.6
  Bottom 0.406: 91.5,47.6 41.2,47.6 38.9,49.9 29.7,49.9 28.8,50.8 28.8,55.2 21.5,62.5 R5.1
PG1
  Bottom 0.406: XIO.21 51.1,48.9 | 51.1,48.9 | 51.1,48.9 42.2,48.9 39.9,51.2 31.3,51.2 30.4,52.1 30.4,55.7 24.5,61.6 24.5,68.32 R6.1
PG2
  Bottom 0.406: XIO.20 106.94,51.44 108.5,53 108.5,68.1 106.4,70.2 106.4,82.5 104.8,84.1 98.1,84.1 98,84 96.36,84 U$6.P7
PG5
  Bottom 0.254: 53.34,74.76 53.34,73.26 54.6,72 59,72 59.7,72.7 59.7,76 59.6,76.1
  Bottom 0.406: PWML.5 53.34,74.76 | 59.6,76.1 58.1,77.6 58.1,80.1 57.1,81.1 57,81.1 56.5,81.6 55,81.6 50.6,86 | 50.6,86 | 50.6,86 48,88.6 44.5,88.6 43.7,87.8 U$5.P6
PH3
  Bottom 0.406: R28.2 28.4,80 29,80.6 31.8,80.6 33,79.4 37.3,79.4 39.7,77 45.56,77 PWML.7
PH4
  Bottom 0.406: R29.2 31.1,79.3 31.9,78.5 36.7,78.5 39.1,76.1 43.92,76.1 PWML.8
PH5  (via drill 0.7 pad 1.42)
  Top 0.305: v15.2,81.3 18.1,81.8 19.2,82.9 19.2,84.45 U$7.P7
  Bottom 0.305: JP6.10 41.66,73.36 40.6,72.3 29.6,72.3 28.6,71.3 16.9,71.3 15.8,72.4 15.8,81.2 v15.2,81.3
PH6
  Bottom 0.305: JP6.9 39.12,74.58 36,77.7 27.7,77.7 27,78.4 27,86.3 24.5,88.8 18.7,88.8 17.8,87.9 17.8,87.12 U$7.P6
PL0
  Bottom 0.254: XIO.30 96.52,38.72 95.3,37.5 91.2,37.5 | U$1.P5 15.66,36.84 15.7,36.8
  Bottom 0.406: 91.2,37.5 29.6,37.5 29.2,37.9 16.9,37.9 15.8,36.8 15.7,36.8
PL1
  Bottom 0.254: 15.7,38.7 15.6,38.7 15,38.1 U$1.P6
  Bottom 0.406: XIO.29 29.74,38.74 29.7,38.7 15.7,38.7
PL2
  Bottom 0.254: XIO.28 96.38,41.28 95.1,40 91.4,40
  Bottom 0.406: 91.4,40 25.02,40 R10.2
PL3
  Bottom 0.406: XIO.27 26.74,41.28 R9.2
PL4
  Bottom 0.254: XIO.26 | XIO.26 95.2,42.5 91.4,42.5
  Bottom 0.305: 7.3,47.6 7.22,65.03 9.02,66.83 12.52,66.83 13.8,65.55 13.8,64.35 U$9.P7
  Bottom 0.406: 91.4,42.5 28.5,42.5 24.9,46.1 17.4,46.1 17,46.5 8.4,46.5 7.3,47.6
PL5
  Bottom 0.305: 8.4,48.9 8.1,49.2 8.1,64 9.4,65.3 10.82,65.3 U$9.P8
  Bottom 0.406: XIO.25 89.22,43.82 89.2,43.8 29,43.8 25,47.8 9.5,47.8 8.4,48.9
PL6
  Bottom 0.254: XIO.24 96.46,46.36 95.2,45.1 91.4,45.1
  Bottom 0.406: 91.4,45.1 29.8,45.1 25.8,49.1 25.8,54.1 25.3,54.6 22.9,54.6 22.5,55 22.5,57.9 20.3,60.1 14.76,60.1 U$9.P5
PL7
  Bottom 0.254: 14.9,62.7 U$9.P6
  Bottom 0.406: XIO.23 55.86,46.36 55.8,46.3 30.8,46.3 27.4,49.7 27.4,54.4 26.2,55.6 24.1,55.6 23.5,56.2 23.5,58.6 20.9,61.2 16.4,61.2 14.9,62.7
RXD1
  Top 0.406: COMMUNICATION1.3 78.71,71.73 COMMUNICATION.3
RXD2
  Top 0.406: COMMUNICATION.5 76.2,74.2 73.8,71.8 73.8,71.17 COMMUNICATION1.5
RXD3
  Top 0.406: COMMUNICATION.7 71.12,74.22 68.6,71.7 68.6,71.05 COMMUNICATION1.7
SCL  (1 unrouted)
  Top 0.406: COMMUNICATION1.1 83.79,71.73 COMMUNICATION.1
SDA
  Top 0.406: COMMUNICATION1.2 81.25,71.73 COMMUNICATION.2
TXD1
  Top 0.406: COMMUNICATION1.4 76.17,71.67 78.4,73.9 78.4,73.96 COMMUNICATION.4
TXD2
  Top 0.406: COMMUNICATION.6 73.66,74.16 71.2,71.7 71.2,71.11 COMMUNICATION1.6
TXD3
  Top 0.406: COMMUNICATION.8 68.2,74.3 66,72.1 66,71.4 66.01,71.39 COMMUNICATION1.8
(copper drawn outside any net)
  shapes: Bottom area x944, Top area x6476

### Text on the board
Top: KRADAC 2014 | MEGAXL-Rev3b
Bottom: WWW.KRADAC.COM | 02/09/2014 | Digital I/O Shield | v 1.0
tPlace: 9 | 8 | 7 | 6 | 5 | 4 | 3 | 2 | 1 | 0 | 22 | 14 | 15 | 16 | 17 | 18 | 19 | 20 | 21 | 13 | 12 | 11 | 10 | 24 | 26 | 28 | 30 | 31 | 32 | 33 | 34 | 35 | 36 | 37 | 38 | 39 | 40 | 41 | 42 | 43 | www.arduino.cc | 44 | 45 | 46 | 47 | TM | 48 | 49 | 50 | 51 | 52 | 53 | 0 | 1 | 2 | 3 | 4 | 5 | 6 | 7 | 8 | 9 | 10 | 11 | 12 | 13 | 14 | 15
tNames: SCL | SDA | 5V | M.Banzi | D.Cuartielles | T.Igoe | GND | AREF | G.Martino | TX | RX | TX3 | RX3 | TX2 | RX2 | TX1 | RX1 | SDA | SCL | D.Mellis | Arduino | MEGA 2560 | DIGITAL | GND | IOREF | RESET | 3V3 | 5V | GND | VIN
ReferenceLC: L | ON | TX | RX | PC1 | PC2
200bmp: C:/Users/Ernesto/eagle/KRADAC/Logo_Kradac_Eagle.bmp